# EAGLE design gc-1000-gps (EAGLE 9.6.2)
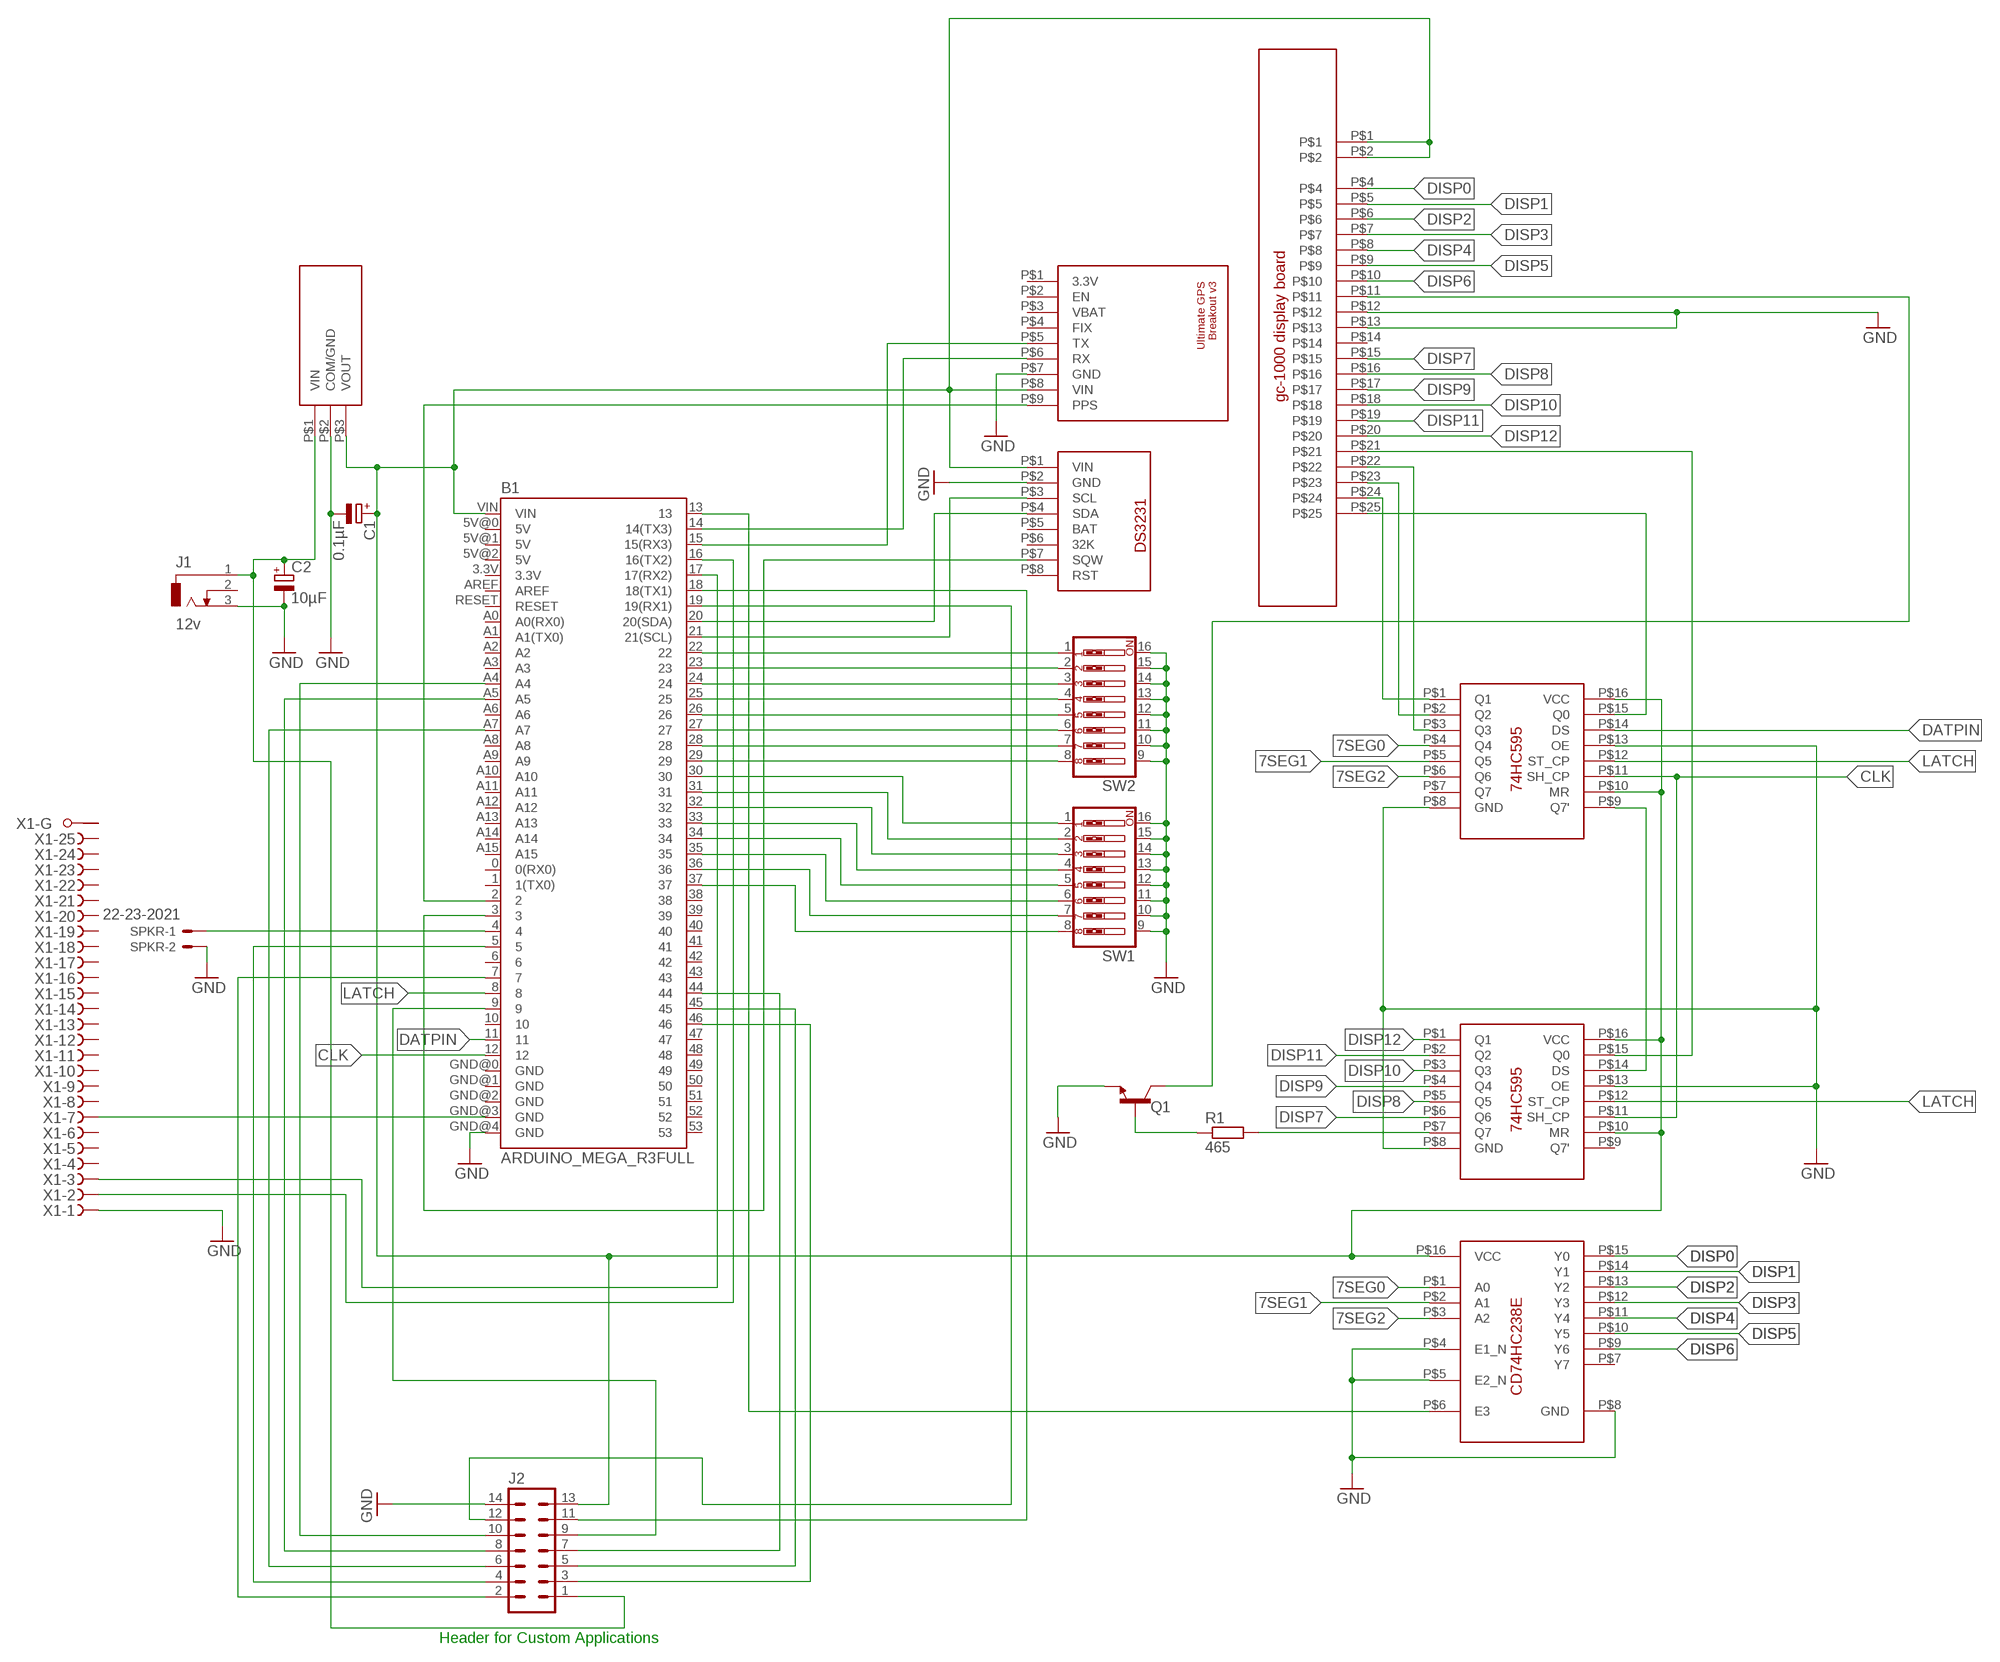
[diagram p0: schematic, sheet 1]

## Parts
B1  ARDUINO_MEGA_R3FULL  [ARDUINO_MEGA]
C1  0.1µF  CPOL-EUE1.8-4  [E1,8-4]
C2  10µF  CPOL-EUE1.8-4  [E1,8-4]
J1  12v  DCJ0303  [DCJ0303]
J2  MA07-2  [MA07-2]
Q1  2N3904  [TO92]
R1  465  R-EU_0207/10  [0207/10]
SPKR  22-23-2021  [22-23-2021]
SW1  SW_DIP-8  [EDG-08]
SW2  SW_DIP-8  [EDG-08]
U1  OKI-78SR  [OKI-78SR]
U$1  PA6H-PROTO  [PA6H]
U$2  CD74HC238E  [CD74HC238E]
U$4  DS3231  [DS3231]
U$5  GC-1000-DISP  [GC-1000-DISP]
U$6  74HC595  [74HC595]
U$7  74HC595  [74HC595]
X1  F25HPS  [F25HP]

## Nets
5VLINE [power]: B1.VIN C1.+ J2.13 U1.P$3(VOUT) U$1.P$8(VIN) U$2.P$16(VCC) U$4.P$1(VIN) U$5.P$1 U$5.P$2 U$6.P$10(MR) U$6.P$16(VCC) U$7.P$10(MR) U$7.P$16(VCC)
7SEG0: U$2.P$1(A0) U$6.P$4(Q4)
7SEG1: U$2.P$2(A1) U$6.P$5(Q5)
7SEG2: U$2.P$3(A2) U$6.P$6(Q6)
B$2: B1.21(21(SCL)) U$4.P$3(SCL)
CLK: B1.12 U$6.P$11(SH_CP) U$7.P$11(SH_CP)
DATPIN: B1.11 U$6.P$14(DS)
DISP0: U$2.P$15(Y0) U$5.P$4
DISP1: U$2.P$14(Y1) U$5.P$5
DISP2: U$2.P$13(Y2) U$5.P$6
DISP3: U$2.P$12(Y3) U$5.P$7
DISP4: U$2.P$11(Y4) U$5.P$8
DISP5: U$2.P$10(Y5) U$5.P$9
DISP6: U$2.P$9(Y6) U$5.P$10
DISP7: U$5.P$15 U$7.P$6(Q6)
DISP8: U$5.P$16 U$7.P$5(Q5)
DISP9: U$5.P$17 U$7.P$4(Q4)
DISP10: U$5.P$18 U$7.P$3(Q3)
DISP11: U$5.P$19 U$7.P$2(Q2)
DISP12: U$5.P$20 U$7.P$1(Q1)
GND: B1.GND@4(GND) C1.- C2.- J1.3 J2.14 Q1.3(E) SPKR.2 SW1.9 SW1.10 SW1.11 SW1.12 SW1.13 SW1.14 SW1.15 SW1.16 SW2.9 SW2.10 SW2.11 SW2.12 SW2.13 SW2.14 SW2.15 SW2.16 U1.P$2(COM/GND) U$1.P$7(GND) U$2.P$4(E1_N) U$2.P$5(E2_N) U$2.P$8(GND) U$4.P$2(GND) U$5.P$12 U$5.P$13 U$6.P$8(GND) U$6.P$13(OE) U$7.P$8(GND) U$7.P$13(OE) X1.1(-1:F)
LATCH: B1.8 U$6.P$12(ST_CP) U$7.P$12(ST_CP)
N$1: B1.3 U$4.P$7(SQW)
N$2 [power]: C2.+ J1.1 J2.1 U1.P$1(VIN)
N$3: B1.20(20(SDA)) U$4.P$4(SDA)
N$4: B1.22 SW2.1
N$5: B1.2 U$1.P$9(PPS)
N$6: B1.23 SW2.2
N$7: B1.24 SW2.3
N$8: B1.25 SW2.4
N$9: B1.26 SW2.5
N$10: B1.27 SW2.6
N$11: B1.28 SW2.7
N$12: B1.29 SW2.8
N$13: B1.30 SW1.1
N$14: B1.31 SW1.2
N$15: B1.32 SW1.3
N$16: B1.33 SW1.4
N$17: B1.34 SW1.5
N$18: B1.35 SW1.6
N$19: B1.36 SW1.7
N$20: B1.37 SW1.8
N$21: B1.4 SPKR.1
N$22: B1.13 U$2.P$6(E3)
N$30: U$5.P$21 U$7.P$15(Q0)
N$31: Q1.2(B) R1.1
N$32: R1.2 U$7.P$7(Q7)
N$33: Q1.1(C) U$5.P$11
N$43: U$5.P$22 U$6.P$3(Q3)
N$44: U$5.P$23 U$6.P$2(Q2)
N$45: U$5.P$24 U$6.P$1(Q1)
N$46: U$5.P$25 U$6.P$15(Q0)
N$47: B1.16(16(TX2)) X1.2(-2:F)
N$48: B1.17(17(RX2)) X1.3(-3:F)
N$49: B1.GND@3(GND) X1.7(-7:F)
N$50: B1.14(14(TX3)) U$1.P$6(RX)
N$51: B1.15(15(RX3)) U$1.P$5(TX)
N$52: B1.A4 J2.10
N$53: B1.19(19(RX1)) J2.12
N$54: B1.18(18(TX1)) J2.11
N$55: B1.A5 J2.8
N$56: B1.A7 J2.6
N$57: B1.5 J2.4
N$58: B1.7 J2.2
N$59: B1.9 J2.9
N$60: B1.44 J2.7
N$61: B1.45 J2.5
N$62: B1.46 J2.3
N$63: U$6.P$9(Q7') U$7.P$14(DS)
Unconnected: B1.0(0(RX0)) B1.1(1(TX0)) B1.3.3V B1.5V@0(5V) B1.5V@1(5V) B1.5V@2(5V) B1.6 B1.10 B1.38 B1.39 B1.40 B1.41 B1.42 B1.43 B1.47 B1.48 B1.49 B1.50 B1.51 B1.52 B1.53 B1.A0(A0(RX0)) B1.A1(A1(TX0)) B1.A2 B1.A3 B1.A6 B1.A8 B1.A9 B1.A10 B1.A11 B1.A12 B1.A13 B1.A14 B1.A15 B1.AREF B1.GND@0(GND) B1.GND@1(GND) B1.GND@2(GND) B1.RESET J1.2 U$1.P$1(3.3V) U$1.P$2(EN) U$1.P$3(VBAT) U$1.P$4(FIX) U$2.P$7(Y7) U$4.P$5(BAT) U$4.P$6(32K) U$4.P$8(RST) U$5.P$14 U$6.P$7(Q7) U$7.P$9(Q7') X1.4(-4:F) X1.5(-5:F) X1.6(-6:F) X1.8(-8:F) X1.9(-9:F) X1.10(-10:F) X1.11(-11:F) X1.12(-12:F) X1.13(-13:F) X1.14(-14:F) X1.15(-15:F) X1.16(-16:F) X1.17(-17:F) X1.18(-18:F) X1.19(-19:F) X1.20(-20:F) X1.21(-21:F) X1.22(-22:F) X1.23(-23:F) X1.24(-24:F) X1.25(-25:F) X1.G1(-G:G1) X1.G2(-G:G2)

## Notes on the sheet
- Header for Custom Applications

## Library data of the parts
B1 = SparkFun-Boards-Custom:ARDUINO_MEGA_R3: Arduino Mega R3 ATmega2560 R3 compatible footprint. SparkFun Products: Arduino Mega 2560 R3 <https://www.sparkfun.com/products/11061>
C1 C2 = rcl:CPOL-EU: POLARIZED CAPACITOR, European symbol; SPICEPREFIX: C
J1 = con-jack:DCJ0303: DC POWER JACK Source: DCJ0303.pdf; OC_FARNELL: unknown; OC_NEWARK: unknown
J2 = con-lstb:MA07-2: PIN HEADER; OC_FARNELL: unknown; OC_NEWARK: unknown
Q1 = transistor:2N3904: NPN TRANSISTOR
R1 = rcl:R-EU_: RESISTOR, European symbol; SPICEPREFIX: R
SPKR = con-molex:22-23-2021: .100" (2.54mm) Center Header - 2 Pin; MF: MOLEX; MPN: 22-23-2021; OC_FARNELL: 1462926; OC_NEWARK: 25C3832
SW1 SW2 = special:SW_DIP-8: DIP SWITCH
U1 = gc-1000-gps custom lib:OKI-78SR
U$1 = gc-1000-gps custom lib:PA6H-PROTO
U$2 = gc-1000-gps custom lib:CD74HC238E
U$4 = gc-1000-gps custom lib:DS3231
U$5 = gc-1000-gps custom lib:GC-1000-DISP
U$6 U$7 = gc-1000-gps custom lib:74HC595
X1 = con-subd:F25HPS: SUB-D; OC_FARNELL: unknown; OC_NEWARK: unknown

## Net classes
0 default: width 0.406 mm, clearance 0.203 mm
1 power: width 0.914 mm, clearance 0.406 mm

## Board
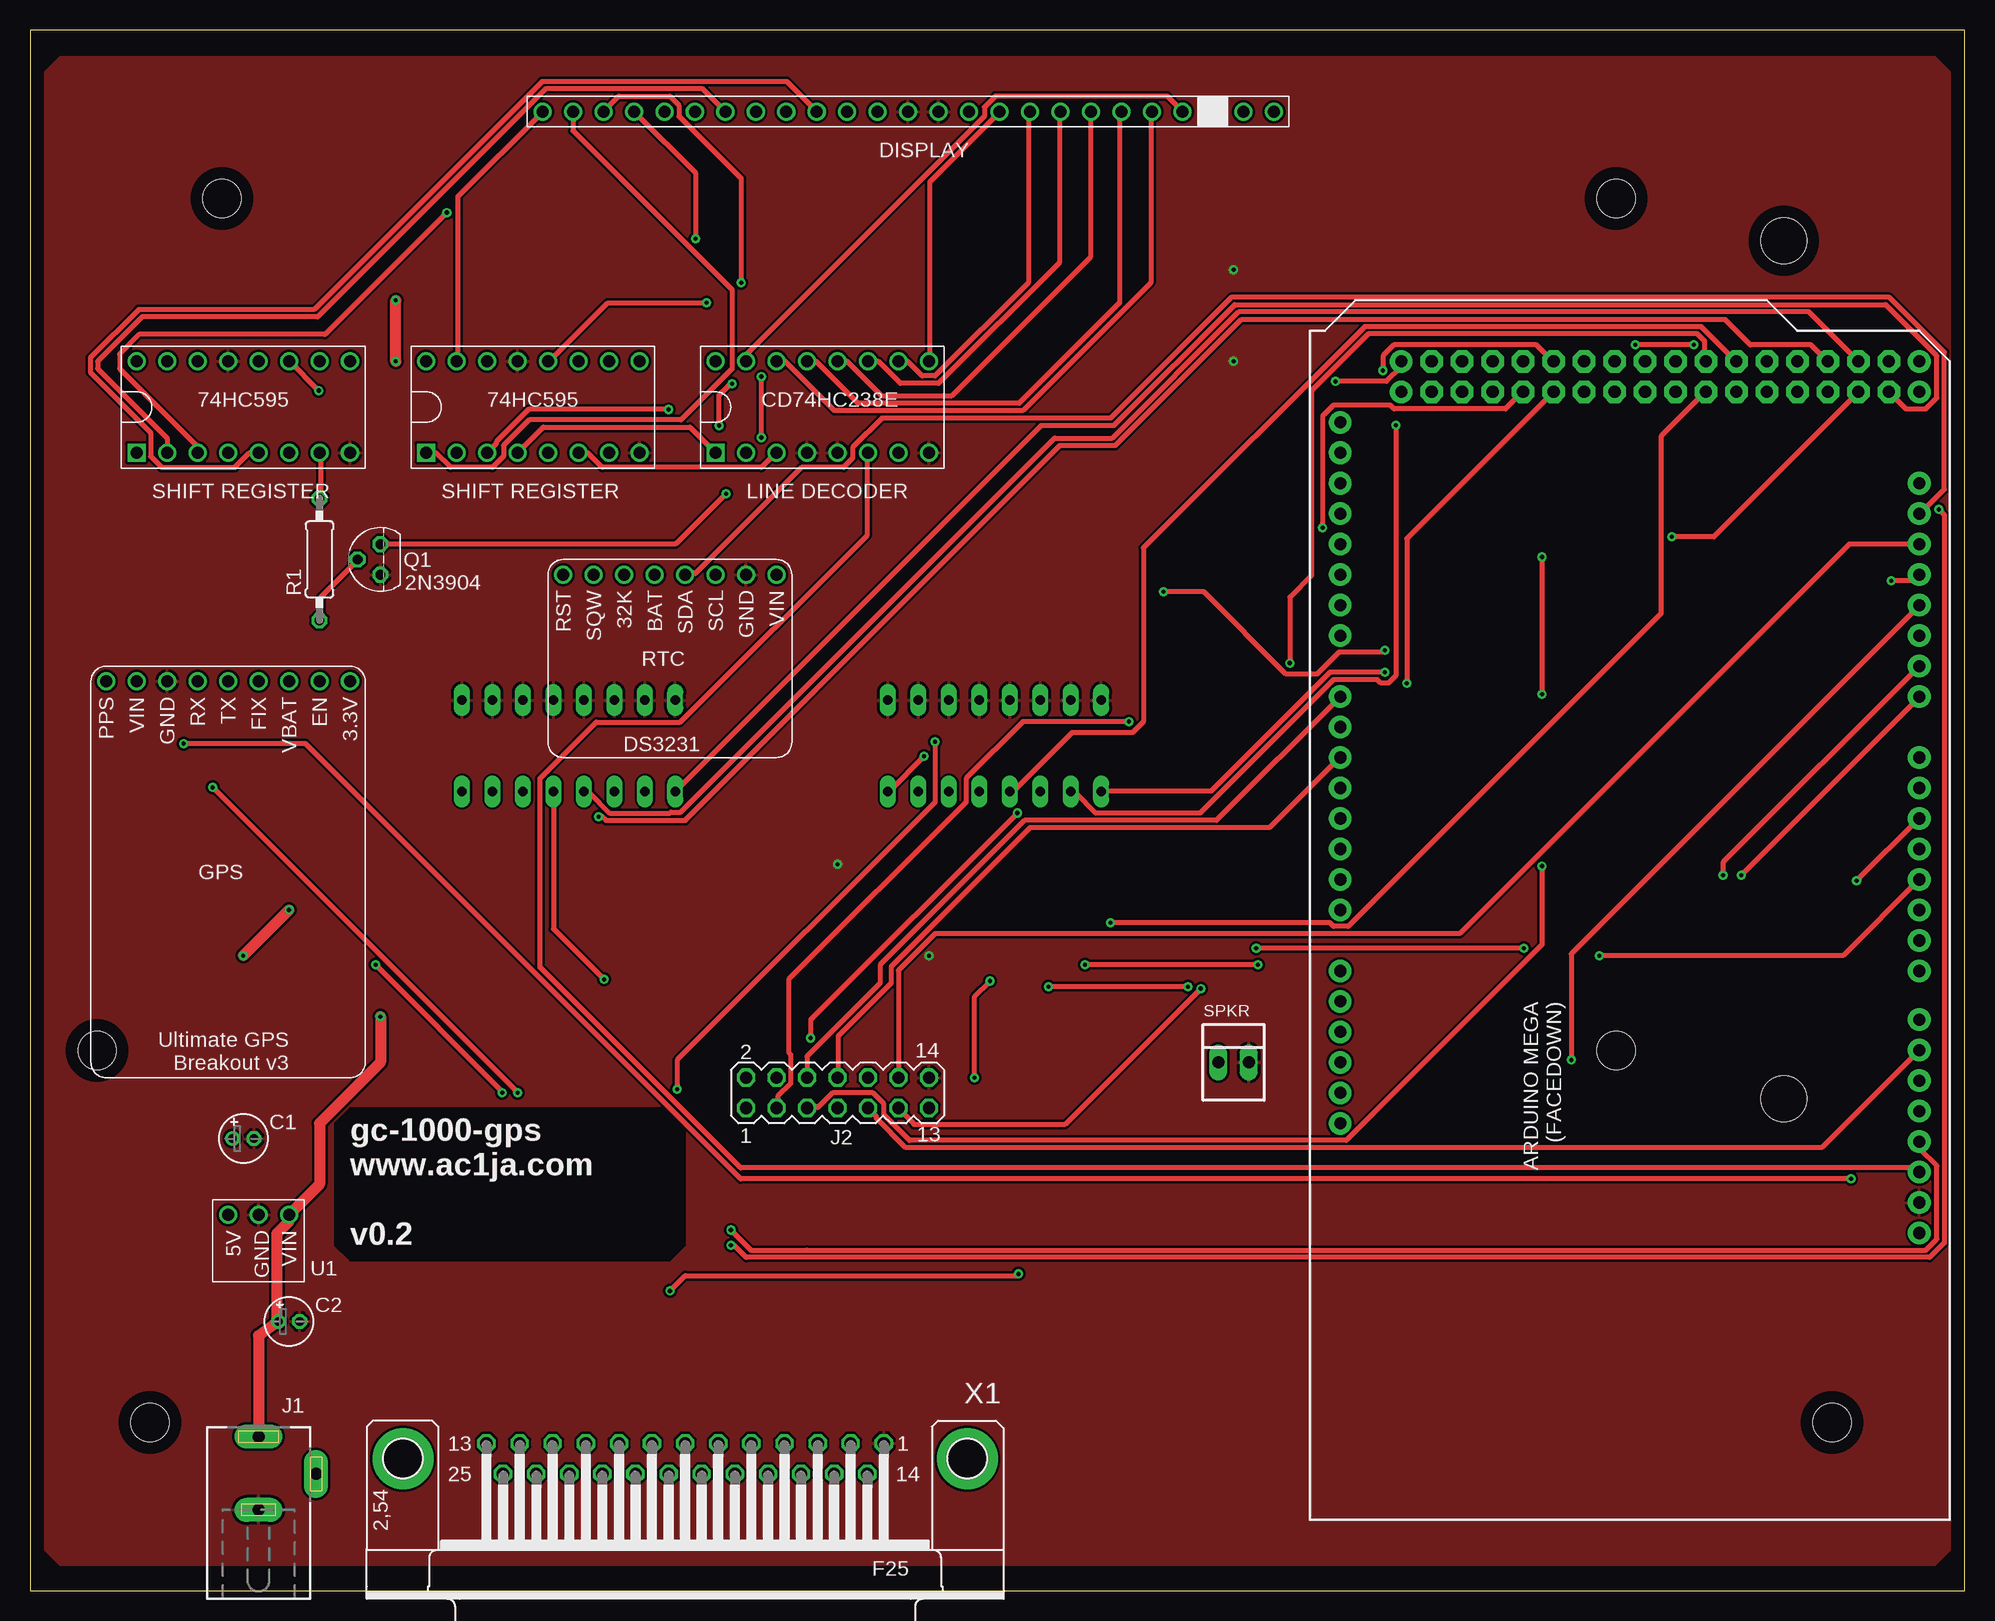
[diagram p1: board, top side]
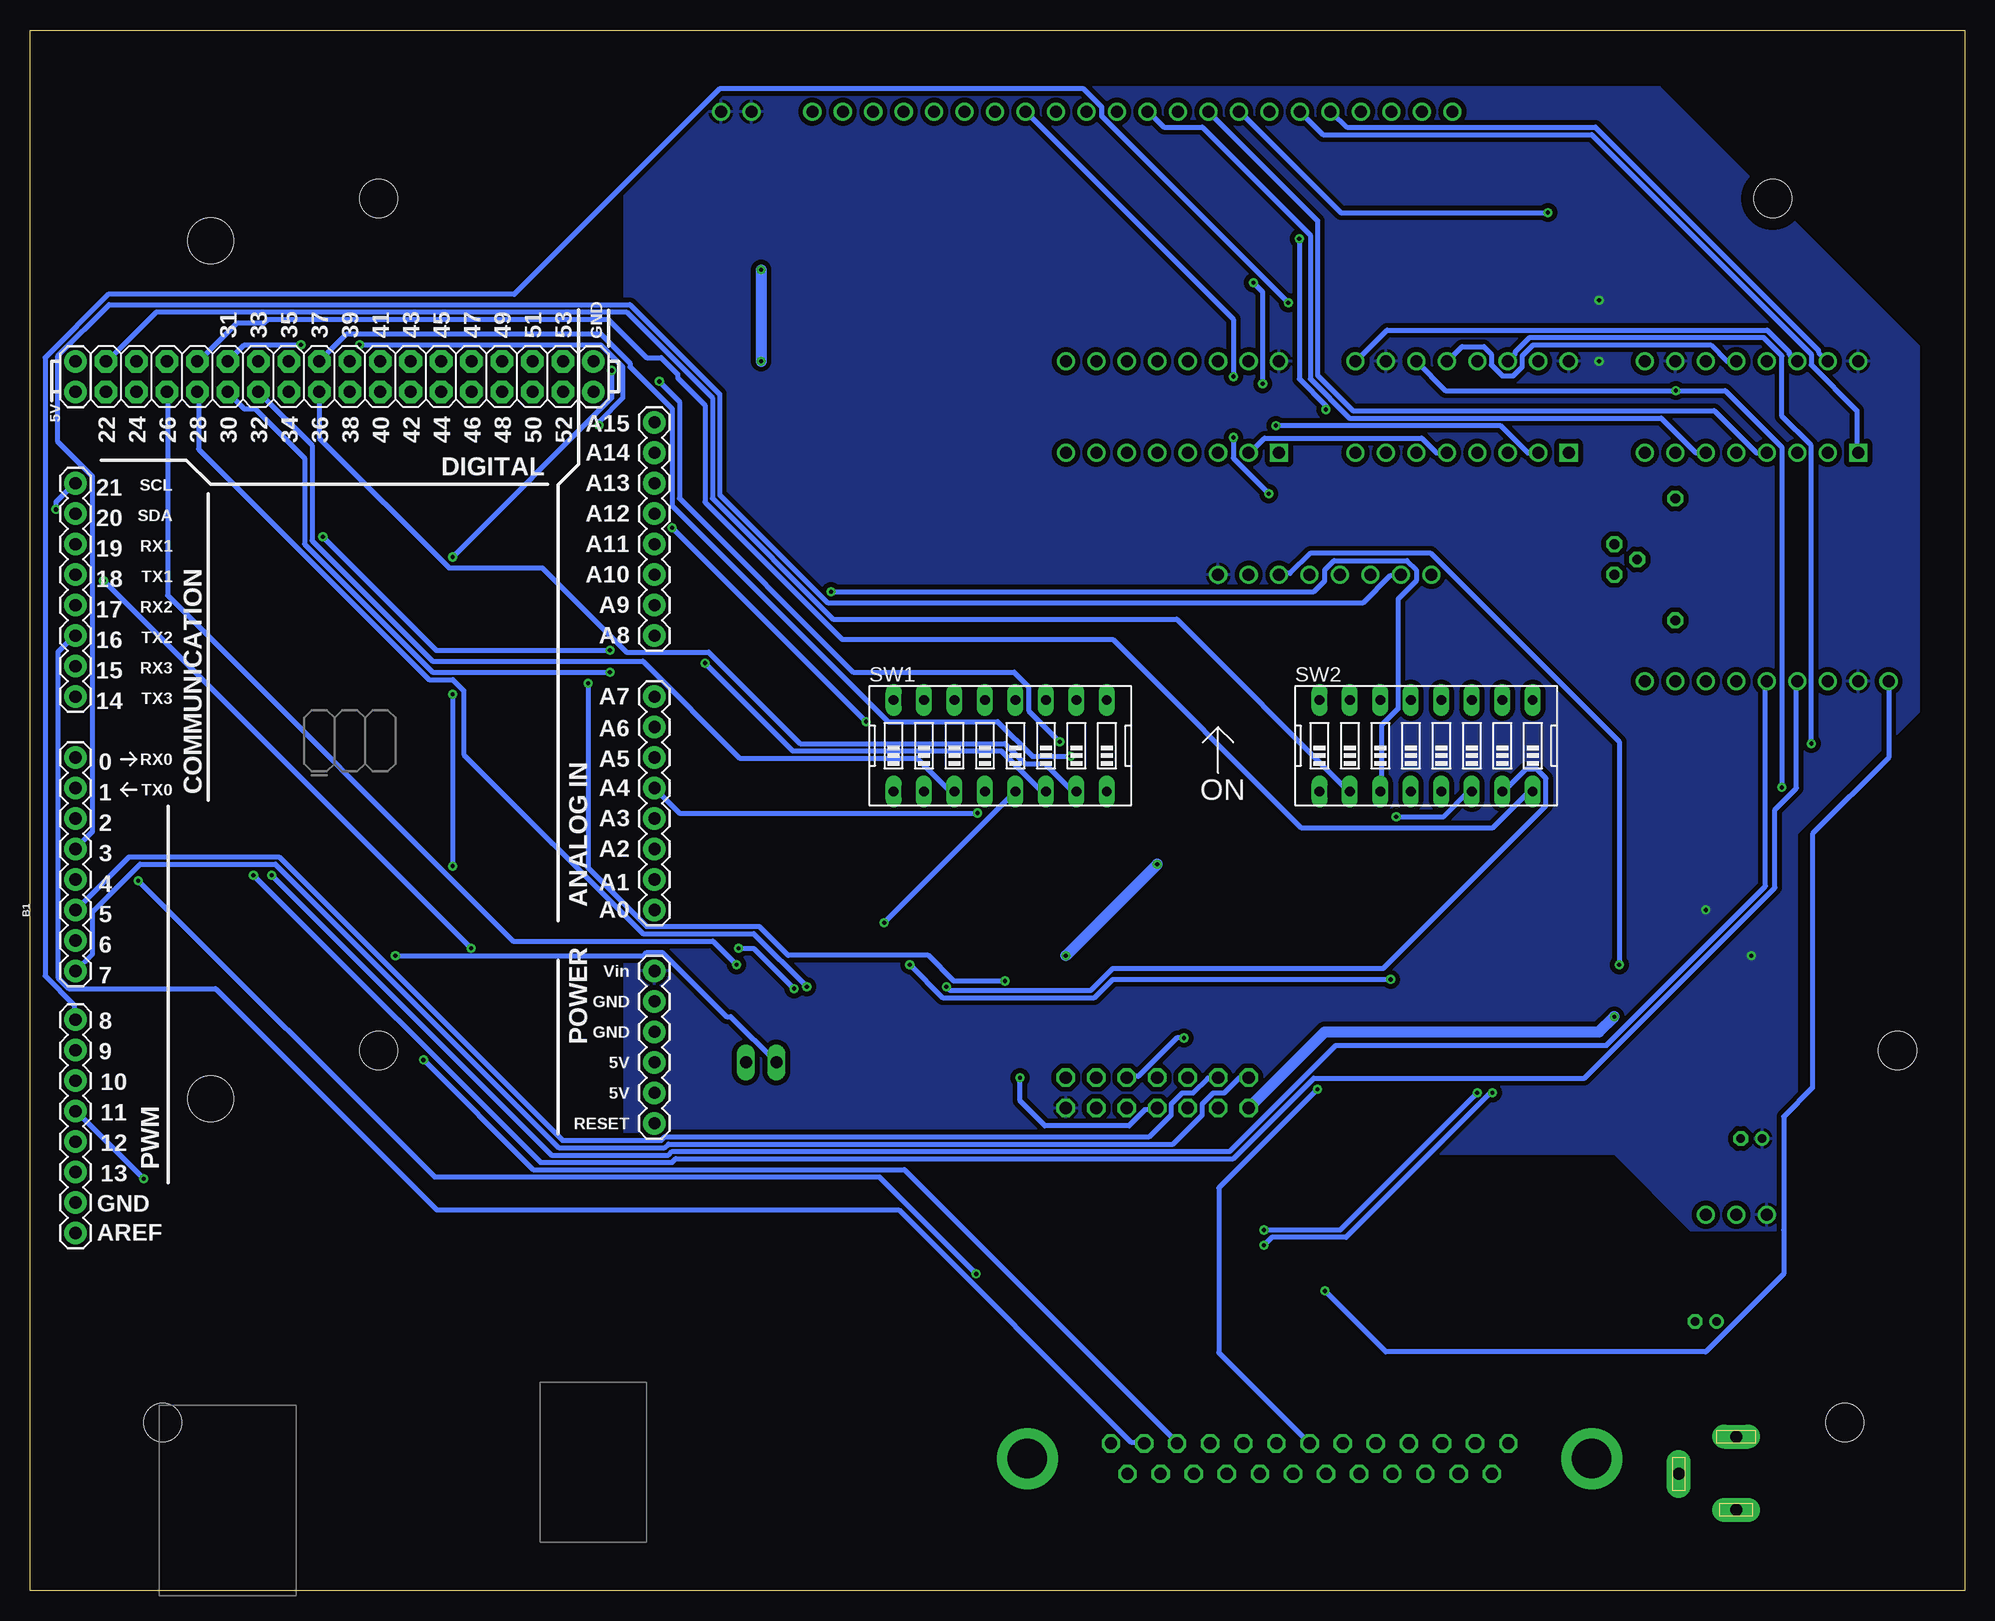
[diagram p2: board, bottom side, seen from below]

Size 161.27 x 130.05 mm. Coordinates in mm from the lower left corner, seen from the top.
Outline: 0,0 161.27,0 161.27,130.05 0,130.05 0,0
Copper layers (1*16): Top 0.035mm / dielectric 1.5mm / Bottom 0.035mm
Design rules "default": minimum track width 6mil, minimum drill 0.35mm, track to track 6mil, track to pad 6mil, pad to pad 6mil, via to via 6mil, smd to smd 6mil, copper to edge 40mil, drill to drill 6mil, minimum pad ring 10mil, minimum via ring 8mil, stop-mask expansion 4mil, vias tented up to drill 0mil, thermal gap 10mil
Holes 3.17 mm at 10,14 132.2,116 16,116 5.6,45 132.2,45 150.2,14
Holes 3.81 mm at 146.2,112.5 146.2,41

### Footprints (pad centres in the part's own frame; a part is rotated, then mirrored left to right if it is on the bottom)
ARDUINO_MEGA = drill 1.016 pad 1.88: 0 13.97,24.13; 1 11.43,24.13; 2 8.89,24.13; 3 6.35,24.13; 3.3V -13.97,-24.13; 4 3.81,24.13; 5 1.27,24.13; 5V@0 -11.43,-24.13; 5V@1 44.45,24.13; 5V@2 46.99,24.13; 6 -1.27,24.13; 7 -3.81,24.13; 8 -7.874,24.13; 9 -10.414,24.13; 10 -12.954,24.13; 11 -15.494,24.13; 12 -18.034,24.13; 13 -20.574,24.13; 14 19.05,24.13; 15 21.59,24.13; 16 24.13,24.13; 17 26.67,24.13; 18 29.21,24.13; 19 31.75,24.13; 20 34.29,24.13; 21 36.83,24.13; A0 1.27,-24.13; A1 3.81,-24.13; A2 6.35,-24.13; A3 8.89,-24.13; A4 11.43,-24.13; A5 13.97,-24.13; A6 16.51,-24.13; A7 19.05,-24.13; A8 24.13,-24.13; A9 26.67,-24.13; A10 29.21,-24.13; A11 31.75,-24.13; A12 34.29,-24.13; A13 36.83,-24.13; A14 39.37,-24.13; A15 41.91,-24.13; AREF -25.654,24.13; GND@0 -8.89,-24.13; GND@1 -6.35,-24.13; GND@2 44.45,-19.05; GND@3 46.99,-19.05; GND@4 -23.114,24.13; RESET -16.51,-24.13; VIN -3.81,-24.13 | drill 1.016 pad 1.88 octagon: 22 44.45,21.59; 23 46.99,21.59; 24 44.45,19.05; 25 46.99,19.05; 26 44.45,16.51; 27 46.99,16.51; 28 44.45,13.97; 29 46.99,13.97; 30 44.45,11.43; 31 46.99,11.43; 32 44.45,8.89; 33 46.99,8.89; 34 44.45,6.35; 35 46.99,6.35; 36 44.45,3.81; 37 46.99,3.81; 38 44.45,1.27; 39 46.99,1.27; 40 44.45,-1.27; 41 46.99,-1.27; 42 44.45,-3.81; 43 46.99,-3.81; 44 44.45,-6.35; 45 46.99,-6.35; 46 44.45,-8.89; 47 46.99,-8.89; 48 44.45,-11.43; 49 46.99,-11.43; 50 44.45,-13.97; 51 46.99,-13.97; 52 44.45,-16.51; 53 46.99,-16.51
E1,8-4 = drill 0.711 pad 1.168: + -0.889,0 | drill 0.711 pad 1.168 octagon: - 0.889,0
DCJ0303 = drill 1 pad 2 long: 1 0,3.1; 2 4.8,0; 3 0,-3
MA07-2 = drill 1.016 octagon: 1 -7.62,-1.27; 2 -7.62,1.27; 3 -5.08,-1.27; 4 -5.08,1.27; 5 -2.54,-1.27; 6 -2.54,1.27; 7 0,-1.27; 8 0,1.27; 9 2.54,-1.27; 10 2.54,1.27; 11 5.08,-1.27; 12 5.08,1.27; 13 7.62,-1.27; 14 7.62,1.27
TO92 = drill 0.813 octagon: 1 1.27,0; 2 0,1.905; 3 -1.27,0
0207/10 = drill 0.813 octagon: 1 -5.08,0; 2 5.08,0
22-23-2021 = drill 1 long: 1 -1.27,0; 2 1.27,0
EDG-08 = drill 0.813 long: 1 -8.89,-3.81; 2 -6.35,-3.81; 3 -3.81,-3.81; 4 -1.27,-3.81; 5 1.27,-3.81; 6 3.81,-3.81; 7 6.35,-3.81; 8 8.89,-3.81; 9 8.89,3.81; 10 6.35,3.81; 11 3.81,3.81; 12 1.27,3.81; 13 -1.27,3.81; 14 -3.81,3.81; 15 -6.35,3.81; 16 -8.89,3.81
OKI-78SR = drill 1: P$1 3.81,0; P$2 1.27,0; P$3 -1.27,0
PA6H = drill 1: P$1 -5.08,0; P$2 -2.54,0; P$3 0,0; P$4 2.54,0; P$5 5.08,0; P$6 7.62,0; P$7 10.16,0; P$8 12.7,0; P$9 15.24,0
CD74HC238E = drill 1 square: P$1 -3.81,8.89 | drill 1: P$2 -3.81,6.35; P$3 -3.81,3.81; P$4 -3.81,1.27; P$5 -3.81,-1.27; P$6 -3.81,-3.81; P$7 -3.81,-6.35; P$8 -3.81,-8.89; P$9 3.81,-8.89; P$10 3.81,-6.35; P$11 3.81,-3.81; P$12 3.81,-1.27; P$13 3.81,1.27; P$14 3.81,3.81; P$15 3.81,6.35; P$16 3.81,8.89
DS3231 = drill 1: P$1 -5.08,0; P$2 -2.54,0; P$3 0,0; P$4 2.54,0; P$5 5.08,0; P$6 7.62,0; P$7 10.16,0; P$8 12.7,0
GC-1000-DISP = drill 1: P$1 -24.13,0; P$2 -21.59,0; P$4 -16.51,0; P$5 -13.97,0; P$6 -11.43,0; P$7 -8.89,0; P$8 -6.35,0; P$9 -3.81,0; P$10 -1.27,0; P$11 1.27,0; P$12 3.81,0; P$13 6.35,0; P$14 8.89,0; P$15 11.43,0; P$16 13.97,0; P$17 16.51,0; P$18 19.05,0; P$19 21.59,0; P$20 24.13,0; P$21 26.67,0; P$22 29.21,0; P$23 31.75,0; P$24 34.29,0; P$25 36.83,0
74HC595 = drill 1 square: P$1 -3.81,8.89 | drill 1: P$2 -3.81,6.35; P$3 -3.81,3.81; P$4 -3.81,1.27; P$5 -3.81,-1.27; P$6 -3.81,-3.81; P$7 -3.81,-6.35; P$8 -3.81,-8.89; P$9 3.81,-8.89; P$10 3.81,-6.35; P$11 3.81,-3.81; P$12 3.81,-1.27; P$13 3.81,1.27; P$14 3.81,3.81; P$15 3.81,6.35; P$16 3.81,8.89
F25HP = drill 1.016 octagon: 1 -16.561,-1.27; 2 -13.792,-1.27; 3 -11.049,-1.27; 4 -8.28,-1.27; 5 -5.512,-1.27; 6 -2.769,-1.27; 7 0,-1.27; 8 2.769,-1.27; 9 5.512,-1.27; 10 8.28,-1.27; 11 11.049,-1.27; 12 13.792,-1.27; 13 16.561,-1.27; 14 -15.189,1.27; 15 -12.421,1.27; 16 -9.652,1.27; 17 -6.909,1.27; 18 -4.14,1.27; 19 -1.372,1.27; 20 1.372,1.27; 21 4.14,1.27; 22 6.909,1.27; 23 9.652,1.27; 24 12.421,1.27; 25 15.189,1.27 | drill 3.302 pad 5.08: G1 -23.52,0; G2 23.52,0

### Placement (x,y rotation side)
B1  133.35,55.45 90 bottom
C1  17.78,37.67 0 top
C2  21.59,22.43 0 top
J1  19.05,9.73 0 top
J2  67.31,41.48 0 top
Q1  29.21,85.93 90 top
R1  24.13,85.93 90 top
SPKR  100.33,44.02 0 top
SW1  80.4,70.4 0 bottom
SW2  44.9,70.4 0 bottom
U1  17.78,31.32 0 top
U$1  21.59,75.77 180 top
U$2  66.04,98.63 90 top
U$4  57.15,84.66 180 top
U$5  79.55,123.24 180 top
U$6  41.91,98.63 90 top
U$7  17.78,98.63 90 top
X1  54.61,11 180 top

### Tracks (layer width: path | path; a pad name or v marks a point on that pad's centre or on a via)
5VLINE  (via drill 0.35)
  Top 0.914: v30.48,102.44 v30.48,107.52 | v21.59,56.72 v17.78,52.91
  pour Bottom: 13.97,31.32 13.97,63.07 3.81,73.23 3.81,103.71 25.4,125.3 110.49,125.3 111.76,124.03 111.76,37.67 110.49,36.4 29.21,36.4 22.86,30.05 15.24,30.05
7SEG0
  Top 0.406: U$6.P$4 42.77,96.95 55.02,96.95 U$2.P$1
7SEG1
  Bottom 0.406: U$6.P$5 44.04,94.82 45.26,96.04 58.37,96.04 59.59,94.82 U$2.P$2
7SEG2
  Top 0.406: U$6.P$6 46.48,94.82 47.7,93.6 60.96,93.6 62.18,94.82 U$2.P$3
B$2  (via drill 0.35)
  Top 0.406: v159.11,90.1 159.56,89.64 159.56,28.98 158.34,27.76 59.69,27.76 58.67,28.78 v58.42,28.78 | v28.8,52.15 39.37,41.58 v39.37,41.48
  Bottom 0.406: v28.8,52.15 28.8,70.74 44.5,86.44 54.56,86.44 56.24,84.76 57.15,84.76 U$4.P$3 | v159.11,90.1 159.11,90.71 157.58,92.23 B1.21 | v58.42,28.78 57.76,29.44 51.57,29.44 39.53,41.48 v39.37,41.48
CLK  (via drill 0.35)
  Top 0.406: v24.08,100 21.64,102.44 U$7.P$11 | B1.12 157.58,37.37 157.58,36.76 158.95,35.38 158.95,29.29 158.04,28.37 64.77,28.37 60.1,28.37 v58.42,30.05 | v15.24,66.93 40.64,41.53 v40.64,41.48
  Bottom 0.406: U$6.P$11 43.28,100 v24.08,100 19.96,100 15.24,95.28 v15.24,66.93 | v40.64,41.48 52.07,30.05 v58.42,30.05
CUTOUT
  cutout Top: 26.67,40.21 25.4,38.94 25.4,28.78 26.67,27.51 53.34,27.51 54.61,28.78 54.61,38.94 53.34,40.21
DATPIN  (via drill 0.35)
  Top 0.406: v12.8,70.59 22.96,70.59 59.23,34.32 v151.79,34.32
  Bottom 0.406: U$6.P$14 37.49,103.05 37.49,103.2 36.27,104.42 16.76,104.42 15.24,102.9 15.24,97.87 12.8,95.43 v12.8,70.59 | v151.79,34.32 157.43,39.96 B1.11
DISP0
  Top 0.406: U$2.P$15 59.74,102.44 59.74,103.05 79.55,122.86 79.55,123.62 80.47,124.54 94.79,124.54 96.01,123.32 U$5.P$4
DISP1
  Top 0.406: U$2.P$14 62.94,102.44 67.06,98.33 82.75,98.33 93.42,108.99 93.42,123.17 U$5.P$5
DISP2
  Top 0.406: U$2.P$13 65.53,102.44 69.04,98.94 82.45,98.94 90.83,107.32 90.83,123.17 U$5.P$6
DISP3
  Top 0.406: U$2.P$12 68.12,102.44 71.02,99.54 76.81,99.54 88.39,111.13 88.39,123.17 U$5.P$7
DISP4
  Top 0.406: U$2.P$11 70.71,102.44 72.54,100.61 75.74,100.61 85.8,110.67 85.8,123.17 U$5.P$8
DISP5
  Top 0.406: U$2.P$10 73.15,102.44 74.37,101.22 75.44,101.22 83.21,108.99 83.21,123.17 U$5.P$9
DISP6
  Top 0.406: U$2.P$9 74.98,102.44 74.98,117.38 80.77,123.17 U$5.P$10
DISP7
  Bottom 0.406: U$7.P$6 22.4,94.82 25.3,97.72 51.31,97.72 54.56,100.97 54.56,112.96 63.55,121.95 66.75,121.95 67.97,123.17 U$5.P$15
DISP8
  Top 0.406: U$7.P$5 18.29,94.82 17.07,93.6 10.97,93.6 10.06,94.52 10.06,96.5 5.03,101.53 5.03,102.75 9.04,106.76 23.67,106.76 42.67,125.76 63.09,125.76 65.53,123.32 U$5.P$16
DISP9
  Bottom 0.406: U$7.P$4 17.37,94.82 20.88,98.33 51,98.33 53.95,101.27 53.95,114.18 62.94,123.17 U$5.P$17
DISP10  (via drill 0.35)
  Top 0.406: v34.75,114.84 24.59,104.68 9.09,104.68 7.47,103.05 7.47,101.83 13.87,95.43 13.87,94.82 U$7.P$3
  Bottom 0.406: v34.75,114.84 52.02,114.84 60.35,123.17 U$5.P$18
DISP11
  Top 0.406: U$7.P$2 11.43,96.04 5.64,101.83 5.64,102.44 9.35,106.15 23.98,106.15 42.98,125.15 56.08,125.15 57.91,123.32 U$5.P$19
DISP12
  Bottom 0.406: U$7.P$1 8.99,94.82 8.99,98.33 12.8,102.14 12.8,103.05 31.09,121.34 53.49,121.34 55.32,123.17 U$5.P$20
GND  (via drill 0.35)
  Bottom 0.914: v100.33,110.06 v100.33,102.44 | v67.31,60.53 v74.93,52.91
  pour Top: 2.54,127.84 158.75,127.84 160.02,126.57 160.02,3.38 158.75,2.11 2.54,2.11 1.27,3.38 1.27,126.57
LATCH  (via drill 0.35)
  Top 0.406: v56.39,107.32 48.16,107.32 43.28,102.44 U$6.P$12
  Bottom 0.406: U$7.P$12 19.81,102.44 21.18,103.81 35.97,103.81 36.88,102.9 36.88,101.98 37.64,101.22 38.56,101.22 39.47,102.14 39.47,103.05 40.08,103.66 41.91,103.66 43.13,102.44 U$6.P$12 | v56.39,107.32 71.93,122.86 71.93,123.62 73.46,125.15 103.78,125.15 120.9,108.03 154.74,108.03 160.02,102.75 160.02,51.23 157.58,48.8 157.58,47.58 B1.8
N$1
  Bottom 0.406: U$4.P$7 47.09,84.61 47.85,84.61 50.14,82.32 94.79,82.32 103.78,91.32 103.78,99.7 111.25,107.16 154.69,107.16 158.95,102.9 158.95,95.73 156.06,92.84 156.06,63.27 157.43,61.9 B1.3
N$2  (via drill 0.35)
  Top 0.914: J1.1 19.05,21.27 C2.+ 20.57,22.43 20.57,29.75 21.59,30.76 U1.P$1 24.13,33.86 24.13,38.94 29.21,44.02 v29.21,47.83
  Bottom 0.914: J2.1 53.34,46.56 30.48,46.56 v29.21,47.83
N$3
  Top 0.406: U$4.P$4 54.71,84.76 55.47,84.76 64.31,93.6 67.82,93.6 68.58,94.36 68.58,95.28 71.02,97.72 90.07,97.72 100.13,107.77 154.99,107.77 159.56,103.2 159.56,91.77 157.58,89.79 B1.20
N$4
  Top 0.406: B1.22 156.36,98.48 158.04,98.48 158.95,99.39 158.95,102.9 154.69,107.16 100.43,107.16 90.37,97.11 84.31,97.11 SW2.1
N$5  (via drill 0.35)
  Top 0.406: v152.25,59.16 157.43,64.34 B1.2 | v53.34,24.97 54.61,26.24 82.25,26.24 v82.4,26.39
  Bottom 0.406: v152.25,59.16 127.56,34.47 90.48,34.47 v82.4,26.39 | U$1.P$9 6.35,69.42 12.7,63.07 12.7,41.89 15.09,39.5 15.09,30.05 15.09,26.39 21.59,19.89 48.26,19.89 v53.34,24.97
N$6
  Bottom 0.406: SW2.2 51.36,66.63 65.68,80.95 94.34,80.95 104.39,91.01 104.39,99.39 111.56,106.56 150.72,106.56 154.84,102.44 B1.23
N$7  (via drill 0.35)
  Top 0.406: v94.49,83.24 97.84,83.24 104.7,76.38 107.29,76.38 109.12,78.21 112.78,78.21 v112.93,78.36 | v136.85,87.81 140.36,87.81 152.4,99.85 B1.24
  Bottom 0.406: v94.49,83.24 54.25,83.24 53.34,84.15 53.34,85.07 52.58,85.83 46.48,85.83 45.72,85.07 45.72,84.15 47.24,82.63 47.24,73.48 48.62,72.11 48.62,66.63 SW2.3 | v112.93,78.36 127.41,78.36 v136.85,87.81
N$8
  Top 0.406: B1.25 148.28,106.56 100.74,106.56 90.22,96.04 85.41,96.04 54.23,64.86 53.41,64.86 53.34,64.8 48.31,64.8 46.63,66.47 46.18,66.47 SW2.4
N$9  (via drill 0.35)
  Top 0.406: v47.85,50.93 43.63,55.15 SW2.5 | v102.36,52.15 v87.94,52.15
  Bottom 0.406: v47.85,50.93 71.02,50.93 72.54,49.41 85.19,49.41 v87.94,52.15 | v102.36,52.15 104.34,54.13 121.01,54.13 149.81,82.93 149.81,99.85 B1.26
N$10  (via drill 0.35)
  Top 0.406: v47.4,64.49 47.7,64.49 48.01,64.19 54.61,64.19 85.85,95.43 90.47,95.43 100.99,105.95 141.28,105.95 143.41,103.81 148.44,103.81 149.81,102.44 B1.27
  Bottom 0.406: v47.4,64.49 43.43,64.49 41.45,66.47 41.15,66.47 SW2.6
N$11  (via drill 0.35)
  Top 0.406: v96.52,50.32 v84.89,50.32
  Bottom 0.406: v84.89,50.32 84.58,50.01 72.85,50.01 71.02,51.84 48.46,51.84 34.9,65.41 34.9,67.69 35.66,68.46 36.58,68.46 38.41,66.63 SW2.7 | v96.52,50.32 100.94,54.74 110.19,54.74 125.12,69.67 125.12,75.01 126.03,75.92 128.02,75.92 147.22,95.13 147.22,99.85 B1.28
N$12
  Bottom 0.406: SW2.8 36.12,66.47 36.42,66.47 39.32,63.58 55.32,63.58 55.78,64.04 71.02,79.28 79.4,79.28 93.57,79.28 105,90.71 105,98.78 107.29,101.07 107.29,101.37 108.66,102.75 109.88,102.75 113.08,105.95 141.43,105.95 141.73,105.64 144.02,105.64 147.22,102.44 B1.29
N$13  (via drill 0.35)
  Top 0.406: v112.93,76.53 108.36,76.53 98.45,66.63 89.31,66.63 SW1.1
  Bottom 0.406: v112.93,76.53 127.71,76.53 138.38,87.2 138.38,94.36 142.49,98.48 143.41,98.48 144.78,99.85 B1.30
N$14  (via drill 0.35)
  Top 0.406: v113.84,97.11 113.84,76.23 113.23,75.62 112.62,75.62 112.32,75.92 108.66,75.92 97.54,64.8 88.85,64.8 87.17,66.47 86.87,66.47 SW1.2 | v138.68,103.81 v133.81,103.81
  Bottom 0.406: v113.84,97.11 113.84,97.41 111.86,99.39 111.86,101.98 113.69,103.81 v133.81,103.81 | v138.68,103.81 143.41,103.81 B1.31
N$15
  Bottom 0.406: B1.32 137.77,95.43 137.77,87.51 127.71,77.45 110.19,77.45 102.11,69.37 87.33,69.37 84.58,66.63 84.28,66.63 SW1.3
N$16
  Top 0.406: SW1.4 81.69,66.63 81.99,66.63 86.87,71.5 91.9,71.5 92.81,72.42 92.81,86.9 111.25,105.34 139.29,105.34 142.19,102.44 B1.33
N$17  (via drill 0.35)
  Top 0.406: v90.07,55.65 108.36,55.65 108.66,55.35 109.88,55.35 135.94,81.41 135.94,96.19 139.6,99.85 B1.34
  Bottom 0.406: v90.07,55.65 79.25,66.47 SW1.5
N$18  (via drill 0.35)
  Top 0.406: v105,77.29 105,82.78 106.83,84.61 106.83,100 111.56,104.73 138.99,104.73 139.6,104.12 139.6,102.44 B1.35
  Bottom 0.406: v105,77.29 97.69,69.98 80.31,69.98 76.96,66.63 76.66,66.63 SW1.6
N$19
  Bottom 0.406: B1.36 137.16,96.04 126.34,85.22 118.57,85.22 111.56,78.21 104.7,78.21 97.08,70.59 80.01,70.59 78.33,68.91 76.66,68.91 74.37,66.63 74.07,66.63 SW1.7
N$20  (via drill 0.35)
  Top 0.406: v74.52,69.52 71.63,66.63 SW1.8
  Bottom 0.406: v74.52,69.52 77.72,69.52 80.62,72.42 89.76,72.42 107.75,90.4 107.75,98.48 111.25,101.98 111.25,102.29 113.69,104.73 134.87,104.73 B1.37
N$21  (via drill 0.35)
  Top 0.406: B1.4 151.13,52.91 v130.81,52.91
  Bottom 0.406: v130.81,52.91 110.14,52.91 109.86,53.19 108.58,53.19 103.22,47.83 102.87,47.83 SPKR.1
N$22
  Top 0.406: B1.13 157.12,35.23 59.23,35.23 42.52,51.95 42.52,67.69 47.19,72.37 54.2,72.37 69.8,87.96 69.8,94.82 U$2.P$6
N$30
  Bottom 0.406: U$7.P$15 12.19,103.2 12.19,103.35 30.79,121.95 51.51,121.95 52.73,123.17 U$5.P$21
N$31
  Top 0.406: R1.1 24.23,80.95 24.23,82.78 27.28,85.83 Q1.2
N$32
  Top 0.406: R1.2 24.23,91.01 24.23,94.82 U$7.P$7
N$33  (via drill 0.35)
  Top 0.406: v60.96,96.09 v60.96,101.17 | v58.01,91.42 53.8,87.2 Q1.1
  Bottom 0.406: v58.01,91.42 60.96,94.36 v60.96,96.09 | v60.96,101.17 60.96,105.95 78.18,123.17 U$5.P$11
N$43  (via drill 0.35)
  Top 0.406: U$6.P$3 38.86,95.58 38.86,95.73 41.55,98.43 v53.24,98.43 | v55.47,112.65 55.47,118.14 50.44,123.17 U$5.P$22
  Bottom 0.406: v53.24,98.43 53.24,98.73 55.47,100.97 v55.47,112.65
N$44  (via drill 0.35)
  Top 0.406: v59.28,108.99 59.28,117.68 54.1,122.86 54.1,123.78 53.34,124.54 49.07,124.54 47.85,123.32 U$5.P$23 | v58.52,100.56 58.42,100.46 58.26,100.46 57.42,99.63 v57.42,97.09
  Bottom 0.406: U$6.P$2 36.42,94.82 38.71,97.11 57.42,97.11 v57.42,97.09 | v59.28,108.99 58.52,108.23 v58.52,100.56
N$45
  Top 0.406: U$6.P$1 33.83,94.82 35.05,93.6 38.56,93.6 39.47,94.52 39.47,95.43 41.6,97.56 54.25,97.56 58.52,101.83 58.52,108.38 45.26,121.64 45.26,123.17 U$5.P$24
N$46
  Top 0.406: U$6.P$15 35.66,102.44 35.66,116.16 42.67,123.17 U$5.P$25
N$47
  Bottom 0.406: X1.2 68.43,12.37 69.49,12.37 88.85,31.73 127.36,31.73 145.8,50.17 158.04,50.17 158.95,51.08 158.95,78.21 157.58,79.58 B1.16
N$48  (via drill 0.35)
  Top 0.406: v128.47,44.22 128.47,53.06 157.43,82.02 B1.17
  Bottom 0.406: v128.47,44.22 119.33,35.08 88.39,35.08 65.68,12.37 X1.3
N$49  (via drill 0.35)
  Top 0.406: v53.95,41.79 53.95,44.22 75.44,65.71 v75.44,70.74 | v108.81,100.76 113.08,100.76 114.3,101.98 B1.GND@3
  Bottom 0.406: X1.7 62.18,19.84 62.18,33.56 v53.95,41.79 | v75.44,70.74 78.03,73.33 78.03,75.31 79.25,76.53 92.66,76.53 107.14,91.01 107.14,99.09 v108.81,100.76
N$50  (via drill 0.35)
  Top 0.406: v142.65,59.62 157.43,74.4 B1.14
  Bottom 0.406: v142.65,59.62 118.72,35.69 107.75,35.69 107.44,35.99 60.96,35.99 54.25,42.7 31.7,42.7 15.82,58.57 15.82,65.08 14.02,66.88 14.02,75.77 U$1.P$6
N$51  (via drill 0.35)
  Top 0.406: v141.12,59.62 141.12,60.68 B1.15
  Bottom 0.406: v141.12,59.62 117.81,36.3 108.05,36.3 107.75,36.6 61.27,36.6 52.43,45.44 29.87,45.44 16.61,58.7 16.61,75.77 U$1.P$5
N$52  (via drill 0.35)
  Top 0.406: v65.08,46.05 65.08,47.58 v82.3,64.8
  Bottom 0.406: v65.08,46.05 65.68,46.05 68.89,42.85 69.8,42.85 J2.10 | v82.3,64.8 107.14,64.8 B1.A4
N$53
  Top 0.406: J2.12 72.39,51.69 75.44,54.74 119.18,54.74 151.64,87.2 B1.19
N$54  (via drill 0.35)
  Top 0.406: v97.59,50.17 86.26,38.84 73.66,38.84 73.66,38.94 J2.11 | v124.51,53.52 v102.21,53.52 | v155.14,84.15 156.97,84.15 B1.18
  Bottom 0.406: v102.21,53.52 100.94,53.52 v97.59,50.17 | v155.14,84.15 v124.51,53.52
N$55
  Top 0.406: J2.8 67.36,42.85 67.36,46.2 71.78,50.62 71.78,52 83.36,63.58 103.33,63.58 109.12,69.37 B1.A5
N$56
  Top 0.406: J2.6 64.77,44.53 70.87,50.62 70.87,52.15 82.91,64.19 98.91,64.19 B1.A7
N$57
  Bottom 0.406: J2.4 62.33,42.7 63.09,42.7 64.31,41.48 65.23,41.48 66.14,40.57 66.14,39.65 67.97,37.82 108.36,37.82 108.66,37.52 116.89,37.52 140.51,61.14 153.01,61.14 157.43,56.72 B1.5
N$58
  Bottom 0.406: B1.7 156.06,53.06 156.06,56.57 152.09,60.53 140.82,60.53 117.2,36.91 108.36,36.91 108.05,37.21 65.99,37.21 63.55,39.65 63.55,40.57 62.64,41.48 61.72,41.48 60.5,42.7 59.74,42.7 J2.2
N$59
  Top 0.406: J2.9 70.56,39.5 70.56,39.35 73,36.91 149.35,36.91 B1.9
N$60  (via drill 0.35)
  Top 0.406: v114.76,75.62 114.76,87.66 B1.44 | v80.01,50.8 78.74,49.53 v78.74,42.75
  Bottom 0.406: v114.76,75.62 114.76,60.23 109.88,55.35 100.48,55.35 98.07,52.93 86.39,52.93 84.26,50.8 v80.01,50.8 | J2.7 67.36,40.11 68.28,40.11 69.65,38.74 76.67,38.74 78.74,40.81 v78.74,42.75
N$61  (via drill 0.35)
  Top 0.406: v126.03,60.38 126.03,53.82 109.73,37.52 73.3,37.52 71.17,39.65 71.17,40.57 70.26,41.48 66.9,41.48 65.68,40.26 64.77,40.26 J2.5 | v126.03,86.13 v126.03,74.7 | v112.78,101.68 112.78,102.9 113.69,103.81 125.58,103.81 126.95,102.44 B1.45
  Bottom 0.406: v126.03,74.7 v126.03,60.38 | v126.03,86.13 112.78,99.39 v112.78,101.68
N$62  (via drill 0.35)
  Top 0.406: v91.59,72.42 82.75,72.42 78.03,67.69 78.03,65.71 63.25,50.93 63.25,44.83 63.4,44.68 63.4,42.24 62.33,41.18 62.33,40.26 J2.3 | v107.75,88.57 107.75,97.87 108.66,98.78 113.39,98.78 113.69,98.48 122.99,98.48 124.36,99.85 B1.46
  Bottom 0.406: v107.75,88.57 v91.59,72.42
N$63
  Bottom 0.406: U$7.P$14 14.02,102.44 14.63,103.05 14.63,103.2 16.46,105.03 48.16,105.03 50.75,102.44 U$6.P$9

### Text on the board
tPlace: 2N3904 | 2 | 13 | gc-1000-gps / www.ac1ja.com / / v0.2
bPlace: ON